# EAGLE schematic crc (EAGLE 7.3.0)
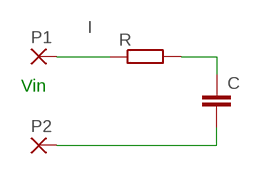
[diagram p0: schematic, sheet 1]

## Parts
C  C5/3  [C5B3]
P1  2,54/1,0  [2,54/1,0]
P2  2,54/1,0  [2,54/1,0]
R  R-EU_0207/5V  [0207/5V]

## Nets
I: P1.1(P) R.1
N$1: C.1 R.2
N$2: C.2 P2.1(P)

## Notes on the sheet
- Vin

## Library data of the parts
C = capacitor-wima:C: CAPACITOR naming: grid - package width
P1 P2 = wirepad:2,54/1,0: THROUGH-HOLE PAD
R = resistor:R-EU_: RESISTOR, European symbol